# EAGLE design tweeq-FB_IO V3 (EAGLE 6.4)
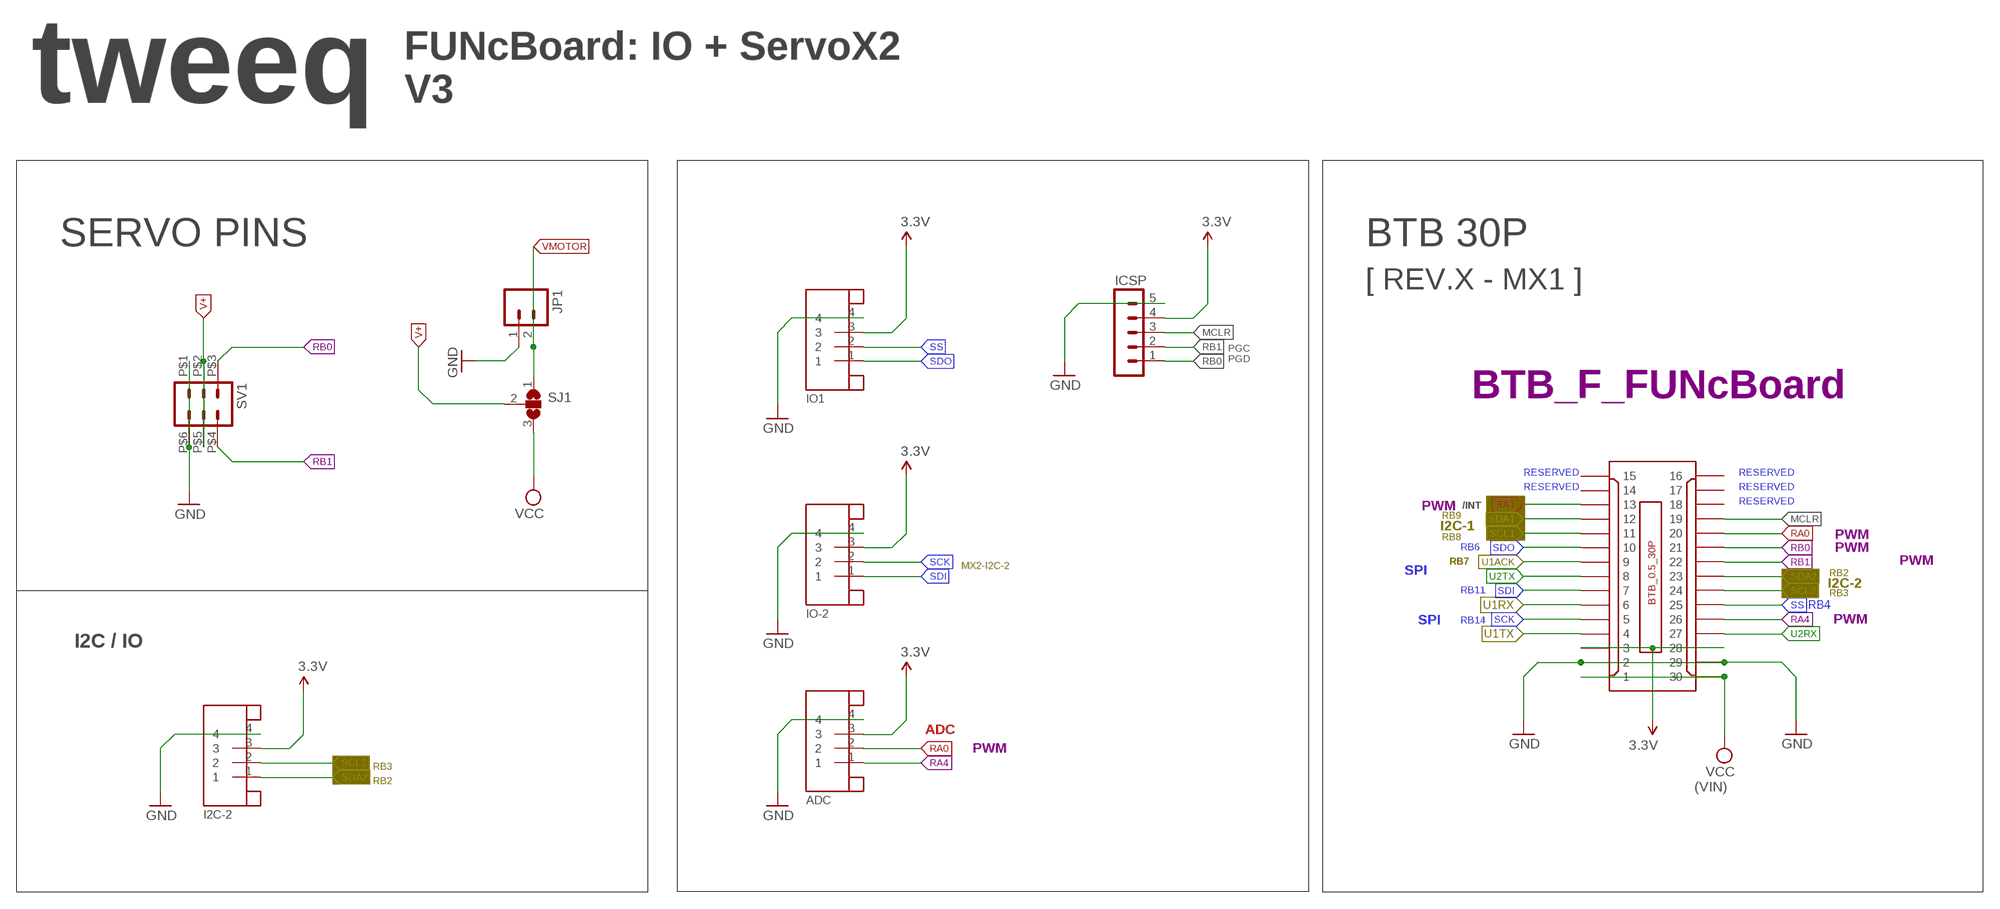
[diagram p0: schematic, sheet 1]

## Parts
ADC  JST-4PINSH  [SH1.0-4PIN]
I2C-2  JST-4PINSH  [SH1.0-4PIN]
ICSP  M05-1NOSILK  [1X05_NOSILK]
IO1  JST-4PINSH  [SH1.0-4PIN]
IO-2  JST-4PINSH  [SH1.0-4PIN]
JP1  M022.54-POL-TH  [1X02_2.54POL_TH]
SJ1  JUMPER_SJ2W  [JUMPER_SJ_2]
SV1  M03-2EDGE_PAD  [2X03_EDGEPAD]
U$1  BTB_CONN_30P/F  [BTB0.5-30F-3.0G]

## Nets
3.3V: ADC.3 I2C-2.3 ICSP.4 IO1.3 IO-2.3 U$1.3 U$1.28
GND: ADC.4 I2C-2.4 ICSP.5 IO1.4 IO-2.4 JP1.1 SV1.P$1 SV1.P$6 U$1.2 U$1.29
MCLR: ICSP.3 U$1.19
RA0: ADC.2 U$1.20
RA1: U$1.13
RA4: ADC.1 U$1.26
RB0: ICSP.1 SV1.P$3 U$1.21
RB1: ICSP.2 SV1.P$4 U$1.22
SCK: IO-2.2 U$1.5
SCL1: U$1.11
SCL2: I2C-2.2 U$1.24
SDA1: U$1.12
SDA2: I2C-2.1 U$1.23
SDI: IO-2.1 U$1.7
SDO: IO1.1 U$1.10
SS: IO1.2 U$1.25
U1ACK: U$1.9
U1RX: U$1.6
U1TX: U$1.4
U2RX: U$1.27
U2TX: U$1.8
V+: SJ1.2 SV1.P$2 SV1.P$5
VCC: SJ1.3 U$1.1 U$1.30
VMOTOR: JP1.2 SJ1.1
Unconnected: U$1.14 U$1.15 U$1.16 U$1.17 U$1.18

## Notes on the sheet
- FUNcBoard: IO + ServoX2
- tweeq | V3
- SERVO PINS | BTB 30P
- [ REV.X - MX1 ]
- PGC
  PGD
- BTB_F_FUNcBoard
- RESERVED | RESERVED
- RESERVED | RESERVED
- PWM | /INT
- RESERVED
- RB9
- I2C-1
- I2C-1
- RB8 | PWM
- RB6 | PWM
- RB7
- SPI | PWM
- MX2-I2C-2
- RB2
- I2C-2
- RB11 | I2C-2
- RB3
- RB4
- SPI
- RB14 | PWM
- I2C / IO
- ADC
- PWM
- RB3
- RB2 | (VIN)

## Library data of the parts
ADC I2C-2 IO1 IO-2 = AISCube:JST-4PIN: JST 4 Pin
ICSP = AISCube:M05-1: PIN HEADER Standard 0.1" header pin 5 pins - 1 way
JP1 = AISCube:M02: Header 2 Standard 2-pin 0.1" header. Use with straight break away headers (SKU : PRT-00116), right angle break away headers (PRT-00553), swiss pins (PRT-00743), machine pins (PRT-00117), and female headers (PRT-00115). Molex polarized connector foot print use with SKU : PRT-08233 with associated crimp pins and housings.
SJ1 = AISCube:JUMPER_SJ2W: SMD solder JUMPER
SV1 = AISCube:M03-2: PIN HEADER
U$1 = AISCube:BTB_CONN_30P: Board to Board Connector SMD 0.5mm Pitch 30 way - Dual Side (2x15) Total Mating height: 3.0mm

## Board
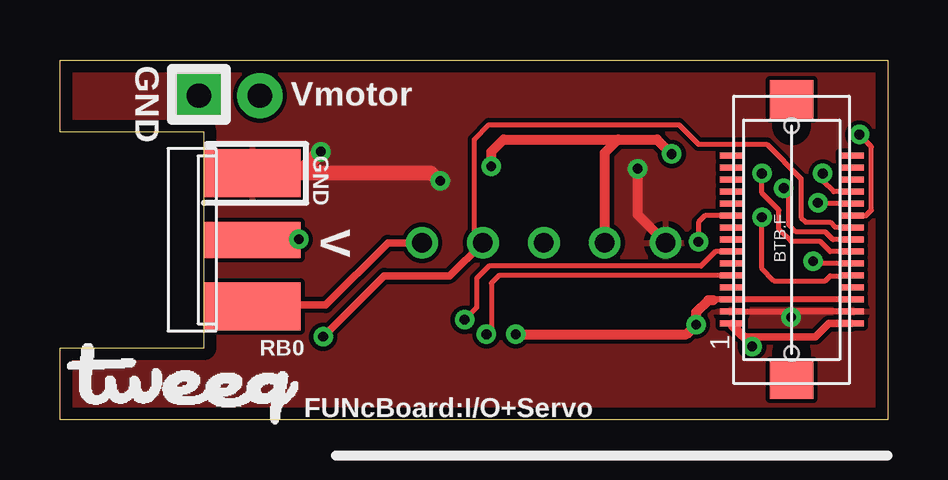
[diagram p1: board, top side]
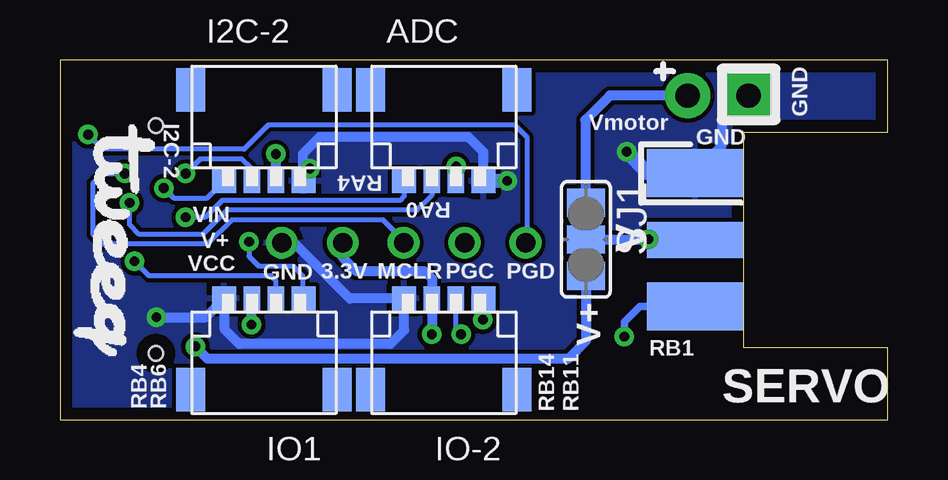
[diagram p2: board, bottom side, seen from below]

Size 34.5 x 15 mm. Coordinates in mm from the lower left corner, seen from the top.
Outline: 0,15 34.5,15 34.5,0 0,0 0,3 6,3 6,12 0,12 0,15
Copper layers (1*16): Top 0.0356mm / dielectric 1.5011mm / Bottom 0.0356mm
Design rules "AISCube": minimum track width 7mil, minimum drill 14mil, track to track 7mil, track to pad 7mil, pad to pad 7mil, via to via 7mil, smd to smd 0mil, copper to edge 20mil, drill to drill 8mil, minimum pad ring 10mil, minimum via ring 8mil, stop-mask expansion 4mil, vias tented up to drill 32mil, thermal gap 10mil

### Footprints (pad centres in the part's own frame; a part is rotated, then mirrored left to right if it is on the bottom)
SH1.0-4PIN = smd 1 x 1: 1 -1.65,-0.55; 4 1.65,-0.55 | smd 0.7 x 1: 2 -0.5,-0.55; 3 0.5,-0.55 | smd 1.2 x 1.8: P$1 -3.05,3.25; P$2 3.05,3.25
1X05_NOSILK = drill 0.813: 1 0,0; 2 2.54,0; 3 5.08,0; 4 7.62,0; 5 10.16,0
1X02_2.54POL_TH = drill 1.016 pad 1.88 square: 1 0,0 | drill 1.016 pad 1.88: 2 2.54,0
JUMPER_SJ_2 = smd 1.168 x 1.6: 1 -1.524,0; 2 0,0; 3 1.524,0
2X03_EDGEPAD = smd 2 x 4: P$1 -2.79,1.54; P$3 2.79,1.54 | smd 1.5 x 4: P$2 0,1.54 | smd 2 x 4 bottom: P$4 2.79,1.54; P$6 -2.79,1.54 | smd 1.5 x 4 bottom: P$5 0,1.54
BTB0.5-30F-3.0G = smd 0.25 x 1: 1 -3.495,2.49; 2 -2.995,2.49; 3 -2.495,2.49; 4 -1.995,2.49; 5 -1.495,2.49; 6 -0.995,2.49; 7 -0.495,2.49; 8 0.005,2.49; 9 0.505,2.49; 10 1.005,2.49; 11 1.505,2.49; 12 2.005,2.49; 13 2.505,2.49; 14 3.005,2.49; 15 3.505,2.49; 16 3.505,-2.51; 17 3.005,-2.51; 18 2.505,-2.51; 19 2.005,-2.51; 20 1.505,-2.51; 21 1.005,-2.51; 22 0.505,-2.51; 23 0.005,-2.51; 24 -0.495,-2.51; 25 -0.995,-2.51; 26 -1.495,-2.51; 27 -1.995,-2.51; 28 -2.495,-2.51; 29 -2.995,-2.51; 30 -3.495,-2.51 | smd 1.6 x 1.8: P$1 -5.845,0; P$2 5.855,0 | hole 0.6: -4.745,0; 4.755,0

### Placement (x,y rotation side)
ADC  18.5,10.5 0 bottom
I2C-2  26,10.5 0 bottom
ICSP  15.09,7.37 0 top
IO1  26,4.5 180 bottom
IO-2  18.5,4.5 180 bottom
JP1  5.79,13.51 0 top
SJ1  12.57,7.52 270 bottom
SV1  6.5,7.5 270 top
U$1  30.5,7.5 90 top
U$2  [TWEEQ-LOGO-M]  0.3,-0.2 0 top
U$3  [TWEEQ-LOGO-M]  33.93,12.29 270 bottom

### Tracks (layer width: path | path; a pad name or v marks a point on that pad's centre or on a via)
3.3V  (via drill 0.41)
  Top 0.254: U$1.28 U$1.3 27.25,5 27.23,4.98
  Top 0.406: v17.98,10.57 17.98,11.18 18.49,11.68 23.27,11.68 | 23.27,11.68 24.89,11.68 v25.5,11.07 | v19,3.56 26.11,3.56 v26.52,3.96 26.52,4.47 27.03,4.98 27.23,4.98 | ICSP.4 22.71,11.13 23.27,11.68
  Bottom 0.406: ADC.3 18,10.55 v17.98,10.57 | v25.5,11.07 I2C-2.3 | v19,3.56 IO-2.3 19,5.89 19.3,6.2 22.15,6.2 22.71,6.76 ICSP.4 | v26.52,3.96 26.52,5.03 IO1.3
GND  (via drill 0.41)
  Top 0.254: U$1.2 30.24,4.5 v30.48,4.27 30.72,4.5 U$1.29
  Top 0.406: v24.08,10.46 24.08,8.55 ICSP.5
  Top 0.61: v15.85,9.96 15.47,10.29 SV1.P$6 9.98,10.29 v10.87,11.18
  Bottom 0.406: JP1.1 5.89,13.51 6.91,12.5 6.91,11.42 SV1.P$6 | ADC.4 16.85,11.16 17.48,11.79 23.67,11.79 24.38,11.07 24.38,9.98 I2C-2.4 24.35,10.19 v24.08,10.46 | v30.48,4.27 28.43,4.27 IO1.4 27.64,5.04 27.64,3.76 27.03,3.15 20.73,3.15 20.15,3.73 IO-2.4 22.42,5.05 24.75,7.37 ICSP.5
  Bottom 0.61: v15.85,9.96 16.87,9.97 ADC.4 | SV1.P$6 9.98,10.29 v10.87,11.18
  pour Bottom: 0.2,14.83 34.27,14.83 34.27,0.2 0.2,0.2 0.2,2.74 6.2,2.74 6.2,12.09 0.2,12.09
  pour Top: 0.2,14.83 34.27,14.83 34.27,0.2 0.2,0.2 0.2,2.84 6.2,2.84 6.2,12.09 0.2,12.09
MCLR  (via drill 0.41)
  Top 0.203: U$1.19 32.25,9.51 31.8,9.96 v31.8,10.26
  Bottom 0.203: v31.8,10.26 32.72,10.26 33.12,9.86 33.12,7.72 32.72,7.32 28.35,7.32 27.33,8.33 21.03,8.33 20.17,7.47 ICSP.3
RA0  (via drill 0.41)
  Top 0.203: U$1.20 31.64,9.01 v31.6,9.04
  Bottom 0.203: v31.6,9.04 31.6,8.13 31.19,7.72 28.55,7.72 27.53,8.74 19.61,8.74 19,9.35 ADC.2
RA4  (via drill 0.41)
  Top 0.203: U$1.26 32.11,5.99 31.9,5.79 29.77,5.79 29.26,6.3 v29.26,8.43
  Bottom 0.203: ADC.1 20.15,9.31 20.32,9.14 27.74,9.14 28.45,8.43 v29.26,8.43
RB0  (via drill 0.41)
  Top 0.203: U$1.21 33.6,8.51 33.83,8.74 33.83,11.38 v33.33,11.89
  Top 0.305: SV1.P$3 8.11,4.78 11.07,4.78 13.67,7.37 ICSP.1
  Bottom 0.203: ICSP.1 15.04,7.46 15.04,11.79 15.54,12.29 25.81,12.29 26.82,11.28 32.72,11.28 v33.33,11.89
RB1  (via drill 0.41)
  Top 0.203: U$1.22 32.99,8.03 32.31,8.03 32.11,8.23 31.09,8.23 30.89,8.43 30.89,10.06 29.46,11.48 26.62,11.48 25.81,12.29 17.88,12.29 17.27,11.68 17.27,7.76 ICSP.2
  Top 0.305: v10.97,3.45 13.51,5.99 16.23,5.99 ICSP.2
  Bottom 0.305: SV1.P$4 10.33,4.71 10.97,4.06 v10.97,3.45
SCK  (via drill 0.41)
  Top 0.203: U$1.5 18.3,6 17.98,5.69 17.98,3.76 v17.78,3.56
  Bottom 0.203: v17.78,3.56 18,3.78 IO-2.2
SCL2  (via drill 0.41)
  Top 0.203: U$1.24 32.11,7 31.7,7.42 30.48,7.42 29.97,7.92 29.97,8.74 29.26,9.45 v29.26,10.26
  Bottom 0.203: I2C-2.2 26.52,9.97 26.52,10.46 26.92,10.87 28.65,10.87 v29.26,10.26
SDA2  (via drill 0.41)
  Top 0.203: U$1.23 32.22,7.5 31.9,7.82 30.68,7.82 30.38,8.13 30.38,9.45 v30.18,9.65
  Bottom 0.203: I2C-2.1 28.35,9.25 29.77,9.25 v30.18,9.65
SDI  (via drill 0.41)
  Top 0.203: U$1.7 27.32,7 26.72,6.4 17.88,6.4 17.37,5.89 17.37,4.67 v16.87,4.17
  Bottom 0.203: v16.87,4.17 16.87,5.03 IO-2.1
SDO  (via drill 0.41)
  Top 0.203: U$1.10 26.89,8.51 26.62,8.23 v26.62,7.42
  Bottom 0.203: v26.62,7.42 26.62,6.81 26.21,6.4 24.79,6.4 24.38,5.99 24.38,5.08 IO1.1
SS  (via drill 0.41)
  Top 0.203: U$1.25 31.5,6.5 v31.39,6.6
  Bottom 0.203: IO1.2 25.5,5.79 25.7,5.99 30.79,5.99 v31.39,6.6
V+  (via drill 0.41)
  Top 0.406: v9.96,7.52 9.94,7.5 SV1.P$5
  Bottom 0.406: SJ1.2 v9.96,7.52 8.06,7.52 SV1.P$5
VCC  (via drill 0.41)
  Top 0.305: U$1.30 32.05,4 31.5,3.45 28.56,3.45 U$1.1 28.01,3.89 v28.85,3.05 28.85,3.16
  Bottom 0.406: SJ1.3 12.57,3.27 13.31,2.54 28.35,2.54 v28.85,3.05
VMOTOR
  Bottom 0.406: JP1.2 11.58,13.51 12.6,12.5 12.6,9.07 SJ1.1

### Text on the board
tPlace: GND | Vmotor | GND | V | RB0 | FUNcBoard:I/O+Servo
bPlace: GND | Vmotor | I2C-2 | GND | RA4 | RA0 | VIN | V | V+ | PGD | PGC | MCLR | 3.3V | GND | VCC | RB1 | V+ | SERVO | RB11 | RB14 | RB6 | RB4